# Altium project Comms.PrjPcb
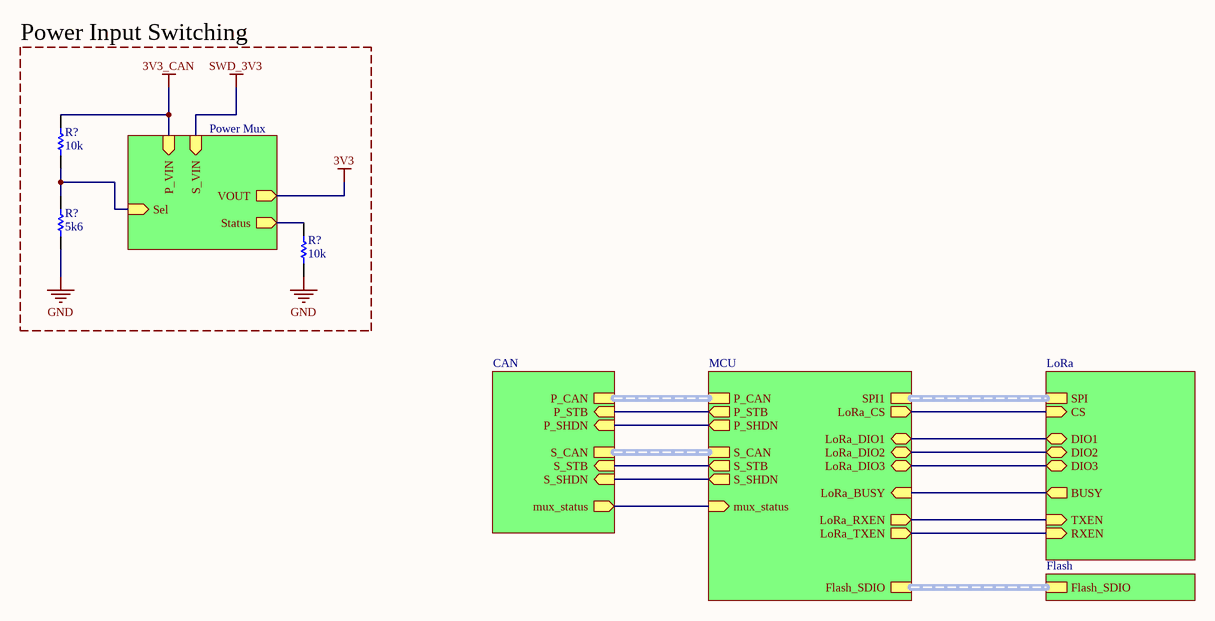
[diagram p0: comms.SchDoc]
8 sheets, 73 parts. Net scope: hierarchical (ports join the sheet entries above them; power ports are global).
Sheets:
  comms.SchDoc
    MCU = mcu.SchDoc
    LoRa = lora.SchDoc
    Flash = flash.SchDoc
    CAN = CAN_bus_powered.SchDoc
      CAN Primary = CAN_transciever.SchDoc
      CAN Secondary = CAN_transciever.SchDoc
      Primary CAN Conn = dual_CAN_conn.SchDoc
      Secondary CAN Conn = dual_CAN_conn.SchDoc
      3V3_mux = power_mux.SchDoc
    Power Mux = power_mux.SchDoc

## Sheet comms.SchDoc
size A4; SheetNumber: 1; SheetTotal: 8

### Parts
(Parts that share a designator on the sheet are numbered #1, #2 ... from top to bottom, then left to right.)
R?#1  10k
R?#2  5k6
R?#3  10k

### Blocks framed on the sheet
Power Input Switching: R?#1-R?#3

### Sub-sheets
CAN = CAN_bus_powered: P_CAN (harness CAN), P_STB (in), P_SHDN (in), S_CAN (harness CAN), S_STB (in), S_SHDN (in), mux_status (out)
Flash = flash: Flash_SDIO (harness SDIO)
LoRa = lora: SPI (harness SPI), DIO1 (bidir), DIO2 (bidir), DIO3 (bidir), BUSY (out), TXEN (in), RXEN (in), CS (in)
MCU = mcu: Flash_SDIO (harness SDIO), LoRa_CS (out), SPI1 (harness SPI), LoRa_BUSY (in), LoRa_RXEN (out), LoRa_TXEN (out), LoRa_DIO1 (bidir), LoRa_DIO2 (bidir), LoRa_DIO3 (bidir), mux_status (in), P_STB (out), P_SHDN (out), S_STB (out), S_SHDN (out), S_CAN (harness CAN), P_CAN (harness CAN)
Power Mux = power_mux: P_VIN (in), S_VIN (in), Sel (in), VOUT (out), Status (out)

### Nets
3V3_CAN: R?#1.2 ; sheet Power Mux/P_VIN  [project net mux_out]
GND: R?#2.1 R?#3.1
LoRa_DIO1: sheet MCU/LoRa_DIO1, sheet LoRa/DIO1
LoRa_DIO2: sheet MCU/LoRa_DIO2, sheet LoRa/DIO2
LoRa_DIO3: sheet MCU/LoRa_DIO3, sheet LoRa/DIO3
LoRa_TXEN: sheet MCU/LoRa_TXEN, sheet LoRa/RXEN
mux_select: R?#1.1 R?#2.2 ; sheet Power Mux/Sel
mux_stat: R?#3.2 ; sheet Power Mux/Status
mux_stat: sheet MCU/mux_status, sheet CAN/mux_status  [a separate net that carries the same name]
P_CAN_SHDN: sheet MCU/P_SHDN, sheet CAN/P_SHDN
P_CAN_STB: sheet MCU/P_STB, sheet CAN/P_STB
S_CAN_SHDN: sheet MCU/S_SHDN, sheet CAN/S_SHDN
S_CAN_STB: sheet MCU/S_STB, sheet CAN/S_STB
NetR6_2: sheet MCU/LoRa_CS, sheet LoRa/CS
NetU2_9: sheet MCU/LoRa_RXEN, sheet LoRa/TXEN
NetU2_11: sheet MCU/LoRa_BUSY, sheet LoRa/BUSY

### Buses and harness runs
harness sheet CAN/P_CAN = sheet MCU/P_CAN
harness sheet CAN/S_CAN = sheet MCU/S_CAN
harness sheet Flash/Flash_SDIO = sheet MCU/Flash_SDIO
harness sheet LoRa/SPI = sheet MCU/SPI1

### Library data of the parts
R?#1-R?#3 = Resistor

## Sheet mcu.SchDoc
size A4; SheetNumber: 2; SheetTotal: 8
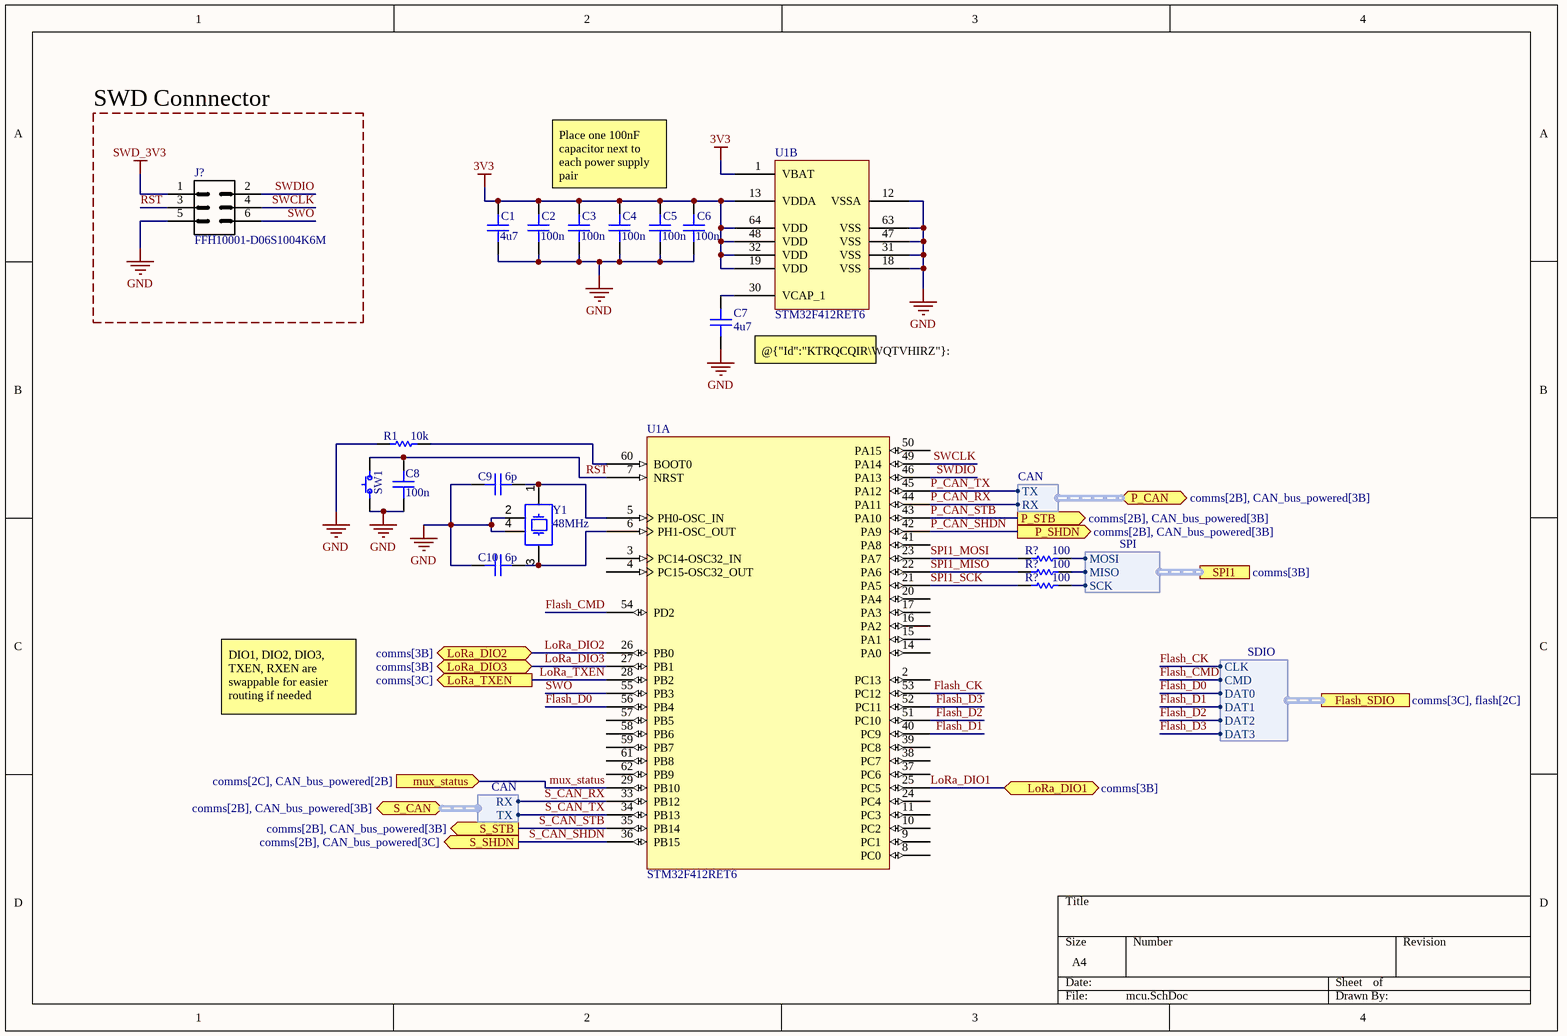
[diagram p1: mcu.SchDoc]

### Parts
(Parts that share a designator on the sheet are numbered #1, #2 ... from top to bottom, then left to right.)
C1  4u7
C2  100n
C3  100n
C4  100n
C5  100n
C6  100n
C7  4u7
C8  100n
C9  6p
C10  6p
J?  FFH10001-D06S1004K6M
R1  10k
R?#4  100
R?#5  100
R?#6  100
SW1  SPST Switch  (value not drawn)
U1  STM32F412RET6  (parts A,B of 2)
Y1  48MHz

### Blocks framed on the sheet
SWD Connnector: J?

### Ports
Flash_SDIO (harness SDIO, see comms[3C], flash[2C]), LoRa_DIO1 (bidir, see comms[3B]), LoRa_DIO2 (bidir, see comms[3B]), LoRa_DIO3 (bidir, see comms[3B]), LoRa_TXEN (out, see comms[3C]), mux_status (in, see comms[2C], CAN_bus_powered[2B]), P_CAN (bidir, harness CAN, see comms[2B], CAN_bus_powered[3B]), P_SHDN (out, see comms[2B], CAN_bus_powered[3B]), P_STB (out, see comms[2B], CAN_bus_powered[3B]), S_CAN (bidir, harness CAN, see comms[2B], CAN_bus_powered[3B]), S_SHDN (out, see comms[2B], CAN_bus_powered[3C]), S_STB (out, see comms[2B], CAN_bus_powered[3B]), SPI1 (harness SPI, see comms[3B])

### Harnesses
SDIO: CLK, CMD, DAT0, DAT1, DAT2, DAT3
CAN: TX, RX
SPI: MISO, SCK, MOSI

### Nets
3V3: C1.2 C2.2 C3.2 C4.2 C5.2 C6.2 U1.1(VBAT) U1.13(VDDA) U1.19(VDD) U1.32(VDD) U1.48(VDD) U1.64(VDD)  [project net mux_out]
GND: C1.1 C2.1 C3.1 C4.1 C5.1 C6.1 C7.1 C8.1 C9.1 C10.1 J?.5 R1.1 SW1.1 U1.12(VSSA) U1.18(VSS) U1.31(VSS) U1.47(VSS) U1.63(VSS) Y1.2(GND) Y1.4(GND)
SWD_3V3: J?.1  [project net secondary_VIN]
Flash_CK: U1.53(PC12) ; port Flash_SDIO.CLK
Flash_CMD: U1.54(PD2) ; port Flash_SDIO.CMD
Flash_D0: U1.56(PB4) ; port Flash_SDIO.DAT0
Flash_D1: U1.40(PC9) ; port Flash_SDIO.DAT1
Flash_D2: U1.51(PC10) ; port Flash_SDIO.DAT2
Flash_D3: U1.52(PC11) ; port Flash_SDIO.DAT3
LoRa_DIO1: U1.25(PC5) ; port LoRa_DIO1
LoRa_DIO2: U1.26(PB0) ; port LoRa_DIO2
LoRa_DIO3: U1.27(PB1) ; port LoRa_DIO3
LoRa_TXEN: U1.28(PB2) ; port LoRa_TXEN
mux_status: U1.29(PB10) ; port mux_status  [project net mux_stat]
P_CAN_RX: U1.44(PA11) ; port P_CAN.RX
P_CAN_SHDN: U1.42(PA9) ; port P_SHDN
P_CAN_STB: U1.43(PA10) ; port P_STB
P_CAN_TX: U1.45(PA12) ; port P_CAN.TX
RST: C8.2 J?.3 SW1.2 U1.7(NRST)
S_CAN_RX: U1.33(PB12) ; port S_CAN.RX
S_CAN_SHDN: U1.36(PB15) ; port S_SHDN
S_CAN_STB: U1.35(PB14) ; port S_STB
S_CAN_TX: U1.34(PB13) ; port S_CAN.TX
SPI1_MISO: R?#5.2 U1.22(PA6)
SPI1_MOSI: R?#4.2 U1.23(PA7)
SPI1_SCK: R?#6.2 U1.21(PA5)
SWCLK: J?.4 U1.49(PA14)
SWDIO: J?.2 U1.46(PA13)
SWO: J?.6 U1.55(PB3)
NetC7_2: C7.2 U1.30(VCAP_1)
NetC9_2: C9.2 U1.5(PH0-OSC_IN) Y1.1(X1)
NetC10_2: C10.2 U1.6(PH1-OSC_OUT) Y1.3(X2)
NetR1_2: R1.2 U1.60(BOOT0)
NetR?#4_1: R?#4.1 ; port SPI1.MOSI
NetR?#5_1: R?#5.1 ; port SPI1.MISO
NetR?#6_1: R?#6.1 ; port SPI1.SCK

Not connected (* = marked no-connect by the designer): U1 2(PC13) 3(PC14-OSC32_IN) 4(PC15-OSC32_OUT) 8(PC0) 9(PC1) 10(PC2) 11(PC3) 14(PA0) 15(PA1) 16(PA2) 17(PA3) 20(PA4) 24(PC4) 37(PC6) 38(PC7) 39(PC8) 41(PA8) 50(PA15) 57(PB5) 58(PB6) 59(PB7) 61(PB8) 62(PB9)

### Notes on the sheet
- Place one 100nF capacitor next to each power supply pair
- @{"Id":"KTRQCQIR\WQTVHIRZ"}: ESR < 1 Ohm
- DIO1, DIO2, DIO3, TXEN, RXEN are swappable for easier routing if needed

### Library data of the parts
C1-C10 = Capacitor
J? = Connector 6-Pin 2 Row
R1 R?#4-R?#6 = Resistor
SW1 = SW_SPST
U1 = STM32F412RET6: 512KB 1.7V~3.6V ARM Cortex-M4 256KB 100MHz FLASH 50 LQFP-64(10x10) Microcontroller Units (MCUs/MPUs/SOCs) ROHS
Y1 = XTAL-4Pin: HCI XC32M4-48.000-F08NLDT / 8pF load capacitance

## Sheet lora.SchDoc: E22-900 LoRa Sheet
size A4; Revision: 1; SheetNumber: 3; SheetTotal: 8
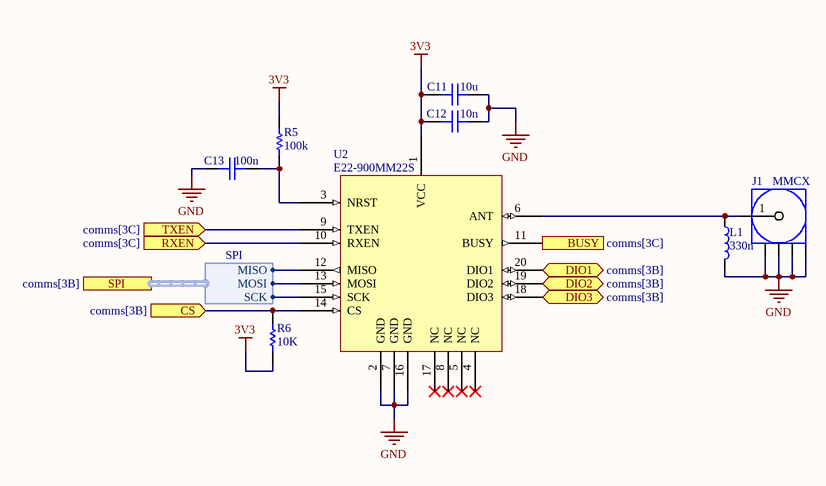
[diagram p2: lora.SchDoc]

### Parts
C11  10u
C12  10n
C13  100n
J1  MMCX
L1  330n
R5  100k
R6  10K
U2  E22-900MM22S

### Ports
BUSY (out, see comms[3C]), CS (in, see comms[3B]), DIO1 (bidir, see comms[3B]), DIO2 (bidir, see comms[3B]), DIO3 (bidir, see comms[3B]), RXEN (in, see comms[3C]), SPI (harness SPI, see comms[3B]), TXEN (in, see comms[3C])

### Harnesses
SPI: MISO, MOSI, SCK

### Nets
3V3: C11.2 C12.2 R5.2 R6.1 U2.1(VCC)  [project net mux_out]
GND: C11.1 C12.1 C13.2 J1.2 J1.3 J1.4 J1.5 L1.2 U2.2(GND) U2.7(GND) U2.16(GND)
LoRa_DIO1: U2.20(DIO1) ; port DIO1
LoRa_DIO2: U2.19(DIO2) ; port DIO2
LoRa_DIO3: U2.18(DIO3) ; port DIO3
LoRa_TXEN: U2.10(RXEN) ; port RXEN
NetC13_1: C13.1 R5.1 U2.3(NRST)
NetJ1_1: J1.1 L1.1 U2.6(ANT)
NetR6_2: R6.2 U2.14(CS) ; port CS
NetR?#4_1: U2.13(MOSI) ; port SPI.MOSI
NetR?#5_1: U2.12(MISO) ; port SPI.MISO
NetR?#6_1: U2.15(SCK) ; port SPI.SCK
NetU2_9: U2.9(TXEN) ; port TXEN
NetU2_11: U2.11(BUSY) ; port BUSY

Not connected (* = marked no-connect by the designer): U2 4(NC)* 5(NC)* 8(NC)* 17(NC)*

### Library data of the parts
C11-C13 = Capacitor
J1 = Conn_Coaxial: Coaxial Connector
L1 = Inductor
R5 R6 = Resistor
U2 = E22-900MM22S: SX1262 868/915MHz ultra small size Lora SMD module

## Sheet flash.SchDoc
size A4; SheetNumber: 4; SheetTotal: 8
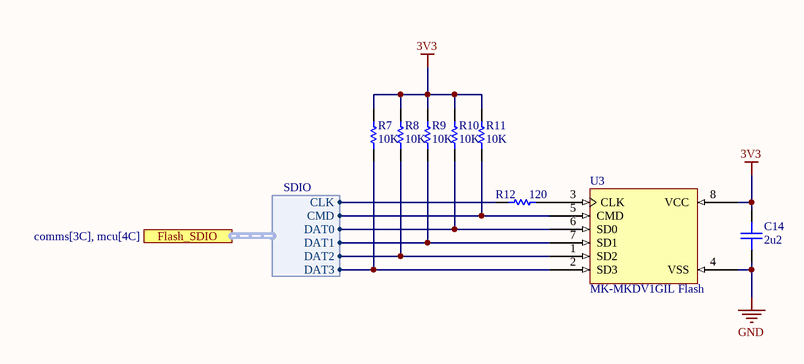
[diagram p3: flash.SchDoc]

### Parts
C14  2u2
R7  10K
R8  10K
R9  10K
R10  10K
R11  10K
R12  120
U3  MK-MKDV1GIL Flash

### Ports
Flash_SDIO (harness SDIO, see comms[3C], mcu[4C])

### Harnesses
SDIO: CLK, CMD, DAT0, DAT1, DAT2, DAT3

### Nets
3V3: C14.2 R7.2 R8.2 R9.2 R10.2 R11.2 U3.8(VCC)  [project net mux_out]
GND: C14.1 U3.4(VSS)
Flash_CK: R12.2 ; port Flash_SDIO.CLK
Flash_CMD: R11.1 U3.5(CMD) ; port Flash_SDIO.CMD
Flash_D0: R10.1 U3.6(SD0) ; port Flash_SDIO.DAT0
Flash_D1: R9.1 U3.7(SD1) ; port Flash_SDIO.DAT1
Flash_D2: R8.1 U3.1(SD2) ; port Flash_SDIO.DAT2
Flash_D3: R7.1 U3.2(SD3) ; port Flash_SDIO.DAT3
NetR12_1: R12.1 U3.3(CLK)

### Library data of the parts
C14 = Capacitor
R7-R12 = Resistor
U3 = MK-MKDV1GIL: 1Gbit LGA-8(6x8) SD NAND FLASH ROHS

## Sheet CAN_bus_powered.SchDoc
size A4; SheetNumber: 5; SheetTotal: 8
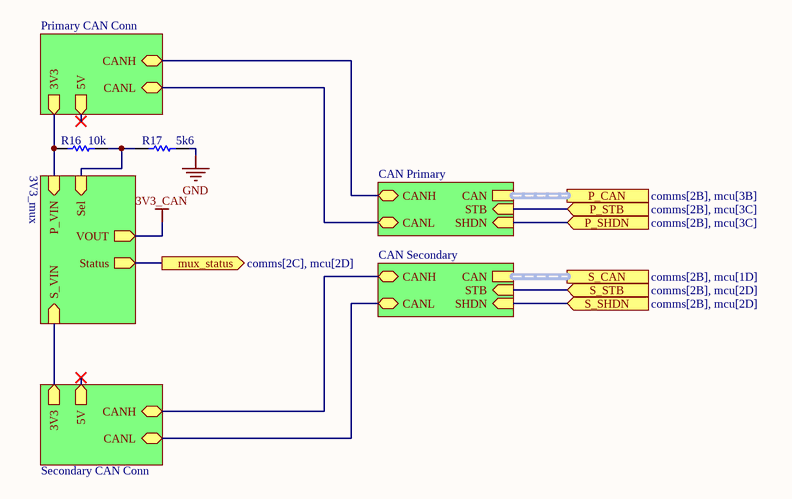
[diagram p4: CAN_bus_powered.SchDoc]

### Parts
R16  10k
R17  5k6

### Sub-sheets
3V3_mux = power_mux: P_VIN (in), S_VIN (in), Sel (in), VOUT (out), Status (out)
CAN Primary = CAN_transciever: CAN (harness CAN), STB (in), SHDN (in), CANH (bidir), CANL (bidir)
CAN Secondary = CAN_transciever: CAN (harness CAN), STB (in), SHDN (in), CANH (bidir), CANL (bidir)
Primary CAN Conn = dual_CAN_conn: 5V (out), 3V3 (out), CANH (bidir), CANL (bidir)
Secondary CAN Conn = dual_CAN_conn: 5V (out), 3V3 (out), CANH (bidir), CANL (bidir)

### Ports
mux_status (out, see comms[2C], mcu[2D]), P_CAN (harness CAN, see comms[2B], mcu[3B]), P_SHDN (in, see comms[2B], mcu[3C]), P_STB (in, see comms[2B], mcu[3C]), S_CAN (harness CAN, see comms[2B], mcu[1D]), S_SHDN (in, see comms[2B], mcu[2D]), S_STB (in, see comms[2B], mcu[2D])

### Nets
GND: R17.1
CANH: sheet CAN Primary/CANH, sheet Primary CAN Conn/CANH
CANH: sheet CAN Secondary/CANH, sheet Secondary CAN Conn/CANH  [a separate net that carries the same name]
CANL: sheet CAN Primary/CANL, sheet Primary CAN Conn/CANL
CANL: sheet CAN Secondary/CANL, sheet Secondary CAN Conn/CANL  [a separate net that carries the same name]
mux_select: R16.1 R17.2 ; sheet 3V3_mux/Sel
mux_stat: port mux_status, sheet 3V3_mux/Status
P_CAN_SHDN: port P_SHDN, sheet CAN Primary/SHDN
P_CAN_STB: port P_STB, sheet CAN Primary/STB
primary_VIN: R16.2 ; sheet Primary CAN Conn/3V3, sheet 3V3_mux/P_VIN
S_CAN_SHDN: port S_SHDN, sheet CAN Secondary/SHDN
S_CAN_STB: port S_STB, sheet CAN Secondary/STB
secondary_VIN: sheet Secondary CAN Conn/3V3, sheet 3V3_mux/S_VIN

### Buses and harness runs
harness port P_CAN = sheet CAN Primary/CAN
harness port S_CAN = sheet CAN Secondary/CAN

### Library data of the parts
R16 R17 = Resistor

## Sheet CAN_transciever.SchDoc
size A4; SheetNumber: 6; SheetTotal: 8
Used 2 times, as channels CAN/CAN Primary, CAN/CAN Secondary. Parts and nets are listed once, with the designators drawn on the sheet.
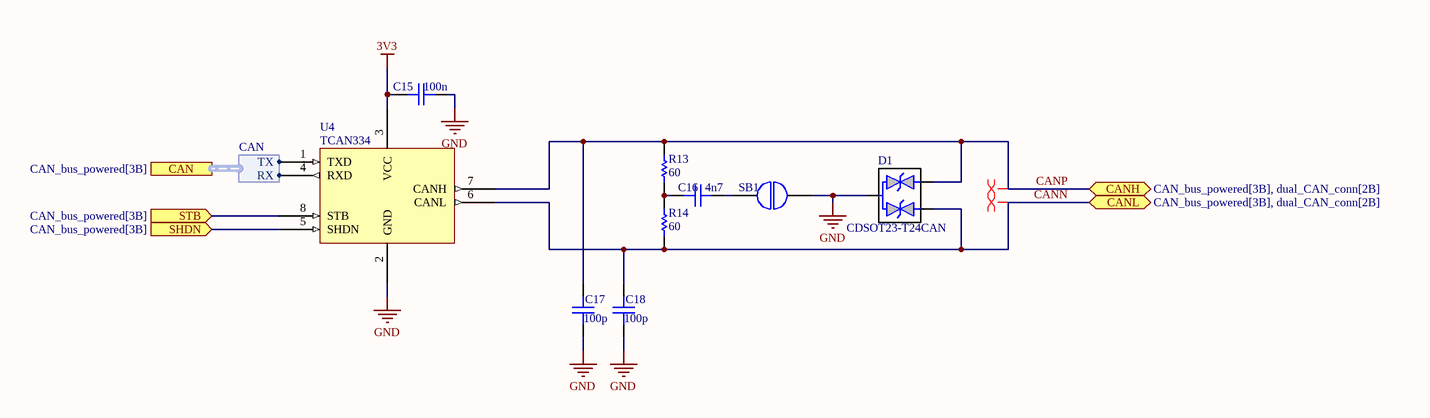
[diagram p5: CAN_transciever.SchDoc]

### Parts
C15  100n
C16  4n7
C17  100p
C18  100p
D1  CDSOT23-T24CAN
R13  60
R14  60
SB1  NO Solder Bridge  (value not drawn)
U4  TCAN334

### Ports
CAN (harness CAN, see CAN_bus_powered[3B]), CANH (bidir, see CAN_bus_powered[3B], dual_CAN_conn[2B]), CANL (bidir, see CAN_bus_powered[3B], dual_CAN_conn[2B]), SHDN (in, see CAN_bus_powered[3B]), STB (in, see CAN_bus_powered[3B])

### Harnesses
CAN: TX, RX

### Nets
3V3: C15.2 U4.3(VCC)
GND: C15.1 C17.2 C18.2 D1.3 SB1.1 U4.2(GND)
CANN: C18.1 D1.1 R14.2 U4.6(CANL) ; port CANL
CANP: C17.1 D1.2 R13.1 U4.7(CANH) ; port CANH
SHDN: U4.5(SHDN) ; port SHDN
STB: U4.8(STB) ; port STB
NetC16_1: C16.1 SB1.2
NetC16_2: C16.2 R13.2 R14.1
NetU4_1: U4.1(TXD) ; port CAN.TX
NetU4_4: U4.4(RXD) ; port CAN.RX

### Channels
CAN/CAN Primary: designators end in _CAN_Primary; ports CANH=CANH CANL=CANL SHDN=P_CAN_SHDN STB=P_CAN_STB
CAN/CAN Secondary: designators end in _CAN_Secondary; ports CANH=CANH CANL=CANL SHDN=S_CAN_SHDN STB=S_CAN_STB

### Layout directives
differential pair: CANH, CANL

### Library data of the parts
C15-C18 = Capacitor
D1 = Dual TVS Diode
R13 R14 = Resistor
SB1 = NO Solder Bridge: Normally Open Solder Bridge
U4 = TCAN334: Can tranciever with shutdown and standby with wake

## Sheet dual_CAN_conn.SchDoc
size A4; SheetNumber: 7; SheetTotal: 8
Used 2 times, as channels CAN/Primary CAN Conn, CAN/Secondary CAN Conn. Parts and nets are listed once, with the designators drawn on the sheet.
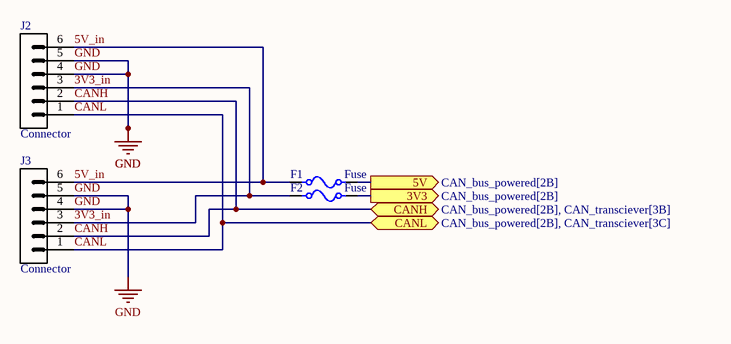
[diagram p6: dual_CAN_conn.SchDoc]

### Parts
F1  Fuse
F2  Fuse
J2  Connector
J3  Connector

### Ports
3V3 (out, see CAN_bus_powered[2B]), 5V (out, see CAN_bus_powered[2B]), CANH (bidir, see CAN_bus_powered[2B], CAN_transciever[3B]), CANL (bidir, see CAN_bus_powered[2B], CAN_transciever[3C])

### Nets
GND: J2.4 J2.5 J3.4 J3.5
3V3: F2.2 ; port 3V3
3V3_in: F2.1 J2.3 J3.3
5V: F1.2 ; port 5V
5V_in: F1.1 J2.6 J3.6
CANH: J2.2 J3.2 ; port CANH
CANL: J2.1 J3.1 ; port CANL

### Channels
CAN/Primary CAN Conn: designators end in _Primary_CAN_Conn; ports 3V3=primary_VIN 5V=NetF1_Primary_CAN_Conn_2 CANH=CANH CANL=CANL
CAN/Secondary CAN Conn: designators end in _Secondary_CAN_Conn; ports 3V3=secondary_VIN 5V=NetF1_Secondary_CAN_Conn_2 CANH=CANH CANL=CANL

### Library data of the parts
J2 J3 = Connector 6-Pin 1 Row: 6 Pin 1 Row Connector

## Sheet power_mux.SchDoc
size A4; SheetNumber: 8; SheetTotal: 8
Used 2 times, as channels CAN/3V3_mux, Power Mux. Parts and nets are listed once, with the designators drawn on the sheet.
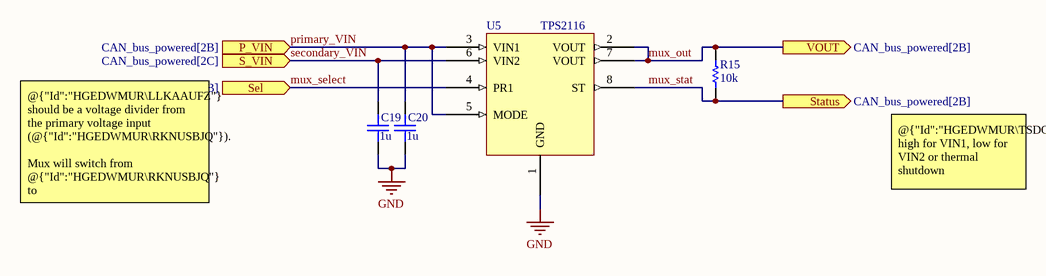
[diagram p7: power_mux.SchDoc]

### Parts
C19  1u
C20  1u
R15  10k
U5  TPS2116

### Ports
P_VIN (in, see CAN_bus_powered[2B]), S_VIN (in, see CAN_bus_powered[2C]), Sel (in, see CAN_bus_powered[2B]), Status (out, see CAN_bus_powered[2B]), VOUT (out, see CAN_bus_powered[2B])

### Nets
GND: C19.1 C20.1 U5.1(GND)
mux_out: R15.2 U5.2(VOUT) U5.7(VOUT) ; port VOUT
mux_select: U5.4(PR1) ; port Sel
mux_stat: R15.1 U5.8(ST) ; port Status
primary_VIN: C20.2 U5.3(VIN1) U5.5(MODE) ; port P_VIN
secondary_VIN: C19.2 U5.6(VIN2) ; port S_VIN

### Channels
CAN/3V3_mux: designators end in _3V3_mux; ports P_VIN=primary_VIN S_VIN=secondary_VIN Sel=mux_select Status=mux_stat VOUT=mux_out
Power Mux: designators end in _Power_Mux; ports P_VIN=mux_out S_VIN=secondary_VIN Sel=mux_select Status=mux_stat VOUT=mux_out

### Notes on the sheet
- @{"Id":"HGEDWMUR\LLKAAUFZ"} should be a voltage divider from the primary voltage input (@{"Id":"HGEDWMUR\RKNUSBJQ"}).
  Mux will switch from @{"Id":"HGEDWMUR\RKNUSBJQ"} to @{"Id":"HGEDWMUR\STDIKBVV"} when the voltage at sel is less than 1V.
- @{"Id":"HGEDWMUR\TSDOJRFR"}: high for VIN1, low for VIN2 or thermal shutdown

### Library data of the parts
C19 C20 = Capacitor
R15 = Resistor
U5 = TPS2116: 1.6 V to 5.5 V, 2.5-A Low IQ Power Mux with Manual and Priority Switchover

## Nets that join several sheets
GND: comms (R?#2.1 R?#3.1), mcu (20 pins), lora (11 pins), flash (C14.1 U3.4), CAN_bus_powered (R17.1), CAN/CAN Primary (6 pins), CAN/CAN Secondary (6 pins), CAN/Primary CAN Conn (J2_Primary_CAN_Conn.4 J2_Primary_CAN_Conn.5 J3_Primary_CAN_Conn.4 J3_Primary_CAN_Conn.5), CAN/Secondary CAN Conn (J2_Secondary_CAN_Conn.4 J2_Secondary_CAN_Conn.5 J3_Secondary_CAN_Conn.4 J3_Secondary_CAN_Conn.5), CAN/3V3_mux (C19_3V3_mux.1 C20_3V3_mux.1 U5_3V3_mux.1), Power Mux (C19_Power_Mux.1 C20_Power_Mux.1 U5_Power_Mux.1)
mux_out: comms (R?#1.2), CAN/3V3_mux (R15_3V3_mux.2 U5_3V3_mux.2 U5_3V3_mux.7), Power Mux (C20_Power_Mux.2 U5_Power_Mux.3 U5_Power_Mux.5)
mux_out: mcu (12 pins), lora (5 pins), flash (7 pins), CAN/CAN Primary (C15_CAN_Primary.2 U4_CAN_Primary.3), CAN/CAN Secondary (C15_CAN_Secondary.2 U4_CAN_Secondary.3), Power Mux (R15_Power_Mux.2 U5_Power_Mux.2 U5_Power_Mux.7)
secondary_VIN: mcu (J?.1), Power Mux (C19_Power_Mux.2 U5_Power_Mux.6)
CANH: CAN/CAN Primary (C17_CAN_Primary.1 D1_CAN_Primary.2 R13_CAN_Primary.1 U4_CAN_Primary.7), CAN/Primary CAN Conn (J2_Primary_CAN_Conn.2 J3_Primary_CAN_Conn.2)
CANH: CAN/CAN Secondary (C17_CAN_Secondary.1 D1_CAN_Secondary.2 R13_CAN_Secondary.1 U4_CAN_Secondary.7), CAN/Secondary CAN Conn (J2_Secondary_CAN_Conn.2 J3_Secondary_CAN_Conn.2)
CANL: CAN/CAN Primary (C18_CAN_Primary.1 D1_CAN_Primary.1 R14_CAN_Primary.2 U4_CAN_Primary.6), CAN/Primary CAN Conn (J2_Primary_CAN_Conn.1 J3_Primary_CAN_Conn.1)
CANL: CAN/CAN Secondary (C18_CAN_Secondary.1 D1_CAN_Secondary.1 R14_CAN_Secondary.2 U4_CAN_Secondary.6), CAN/Secondary CAN Conn (J2_Secondary_CAN_Conn.1 J3_Secondary_CAN_Conn.1)
Flash_CK: mcu (U1.53), flash (R12.2)
Flash_CMD: mcu (U1.54), flash (R11.1 U3.5)
Flash_D0: mcu (U1.56), flash (R10.1 U3.6)
Flash_D1: mcu (U1.40), flash (R9.1 U3.7)
Flash_D2: mcu (U1.51), flash (R8.1 U3.1)
Flash_D3: mcu (U1.52), flash (R7.1 U3.2)
LoRa_DIO1: mcu (U1.25), lora (U2.20)
LoRa_DIO2: mcu (U1.26), lora (U2.19)
LoRa_DIO3: mcu (U1.27), lora (U2.18)
LoRa_TXEN: mcu (U1.28), lora (U2.10)
mux_select: comms (R?#1.1 R?#2.2), Power Mux (U5_Power_Mux.4)
mux_select: CAN_bus_powered (R16.1 R17.2), CAN/3V3_mux (U5_3V3_mux.4)
mux_stat: comms (R?#3.2), Power Mux (R15_Power_Mux.1 U5_Power_Mux.8)
mux_stat: mcu (U1.29), CAN/3V3_mux (R15_3V3_mux.1 U5_3V3_mux.8)
NetR?#4_1: mcu (R?#4.1), lora (U2.13)
NetR?#5_1: mcu (R?#5.1), lora (U2.12)
NetR?#6_1: mcu (R?#6.1), lora (U2.15)
P_CAN_RX: mcu (U1.44), CAN/CAN Primary (U4_CAN_Primary.4)
P_CAN_SHDN: mcu (U1.42), CAN/CAN Primary (U4_CAN_Primary.5)
P_CAN_STB: mcu (U1.43), CAN/CAN Primary (U4_CAN_Primary.8)
P_CAN_TX: mcu (U1.45), CAN/CAN Primary (U4_CAN_Primary.1)
primary_VIN: CAN_bus_powered (R16.2), CAN/Primary CAN Conn (F2_Primary_CAN_Conn.2), CAN/3V3_mux (C20_3V3_mux.2 U5_3V3_mux.3 U5_3V3_mux.5)
S_CAN_RX: mcu (U1.33), CAN/CAN Secondary (U4_CAN_Secondary.4)
S_CAN_SHDN: mcu (U1.36), CAN/CAN Secondary (U4_CAN_Secondary.5)
S_CAN_STB: mcu (U1.35), CAN/CAN Secondary (U4_CAN_Secondary.8)
S_CAN_TX: mcu (U1.34), CAN/CAN Secondary (U4_CAN_Secondary.1)
secondary_VIN: CAN/Secondary CAN Conn (F2_Secondary_CAN_Conn.2), CAN/3V3_mux (C19_3V3_mux.2 U5_3V3_mux.6)